# EAGLE schematic ray_pwr (EAGLE 7.7.0)
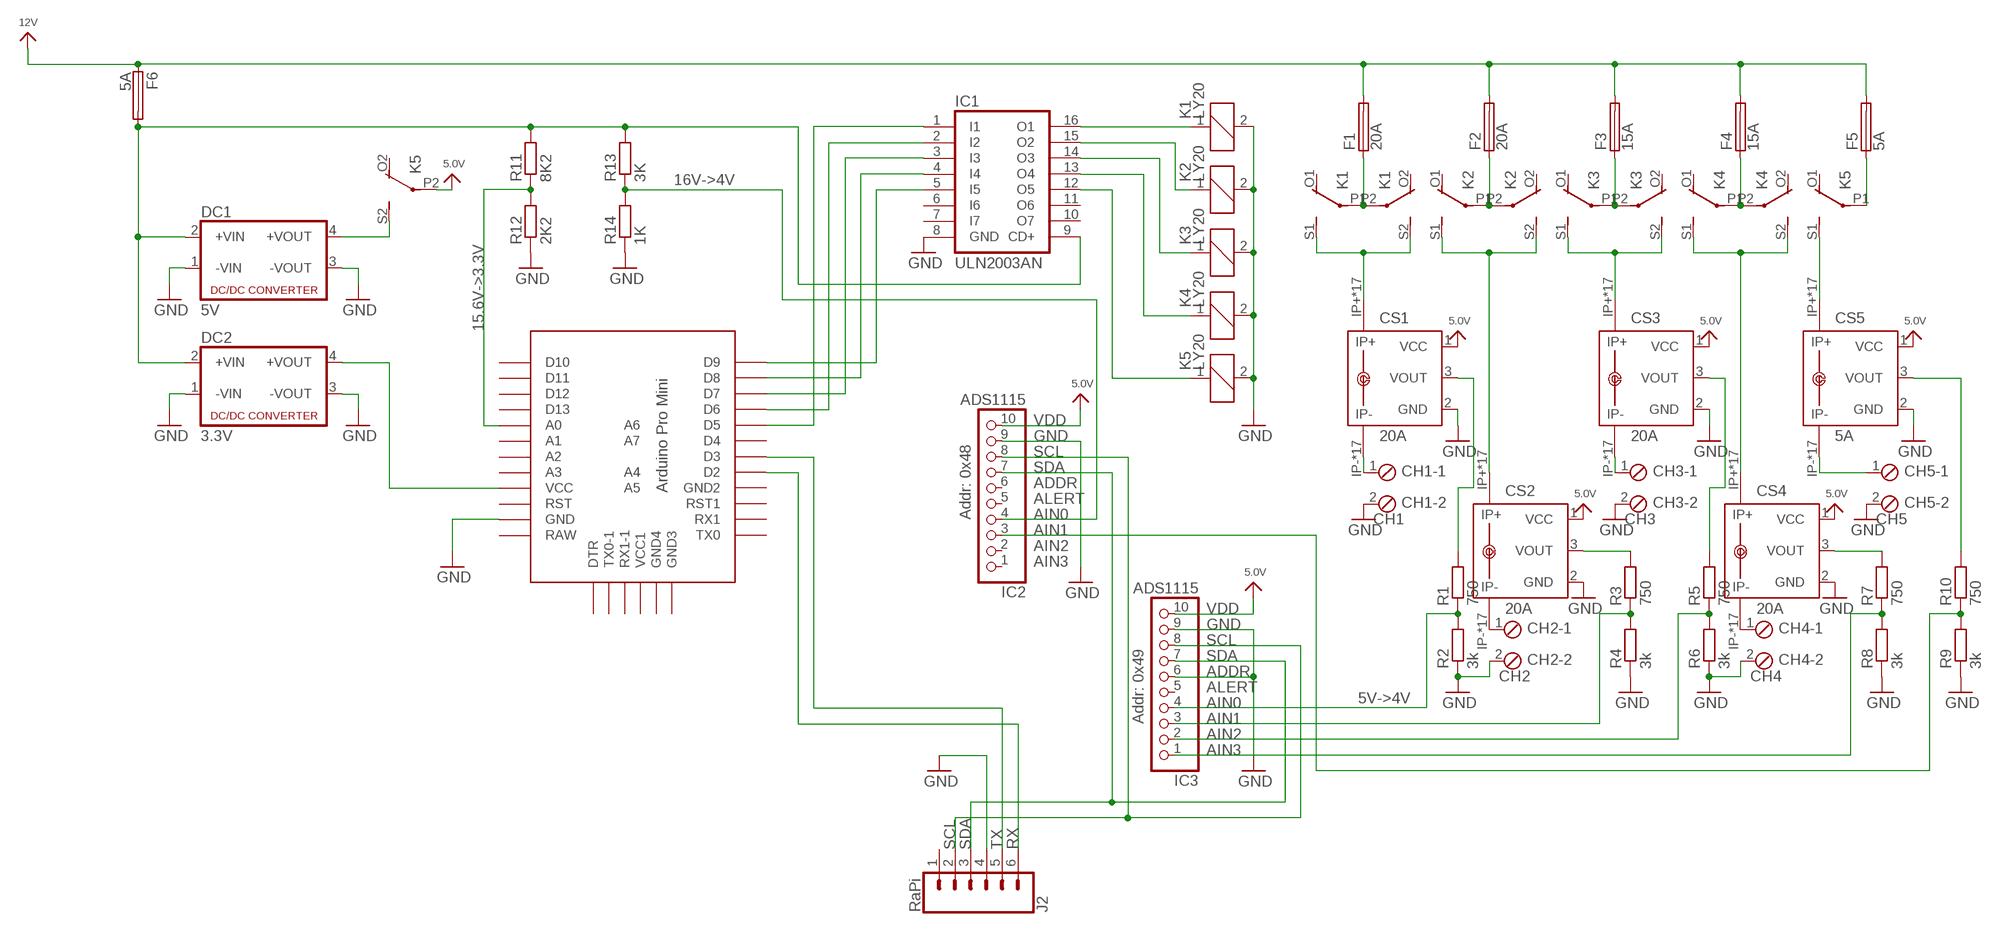
[diagram p0: schematic, sheet 1]

## Parts
CH1  CH1  MPT2  [2POL254]
CH2  CH2  MPT2  [2POL254]
CH3  CH3  MPT2  [2POL254]
CH4  CH4  MPT2  [2POL254]
CH5  CH5  MPT2  [2POL254]
CS1  20A  ACS750LCA-050  [ACS75050]
CS2  20A  ACS750LCA-050  [ACS75050]
CS3  20A  ACS750LCA-050  [ACS75050]
CS4  20A  ACS750LCA-050  [ACS75050]
CS5  5A  ACS750LCA-050  [ACS75050]
DC1  5V  VA-0505S  [4SIL]
DC2  3.3V  VA-0505S  [4SIL]
F1  20A  FUSEBLANK_5X20MM  [FUSE_HOLDER_5X20MM]
F2  20A  FUSEBLANK_5X20MM  [FUSE_HOLDER_5X20MM]
F3  15A  FUSEBLANK_5X20MM  [FUSE_HOLDER_5X20MM]
F4  15A  FUSEBLANK_5X20MM  [FUSE_HOLDER_5X20MM]
F5  5A  FUSEBLANK_5X20MM  [FUSE_HOLDER_5X20MM]
F6  5A  FUSEBLANK_5X20MM  [FUSE_HOLDER_5X20MM]
IC1  ULN2003AN  [DIL16]
IC2  ADS1115  HEADER-1X1070MIL  [1X10_ROUND70]
IC3  ADS1115  HEADER-1X1070MIL  [1X10_ROUND70]
J2  RaPi  CONN_06POLAR  [MOLEX-1X6]
K1  LY20  [LY20]
K2  LY20  [LY20]
K3  LY20  [LY20]
K4  LY20  [LY20]
K5  LY20  [LY20]
R1  750  R-EU_0207/10  [0207/10]
R2  3k  R-EU_0207/10  [0207/10]
R3  750  R-EU_0207/10  [0207/10]
R4  3k  R-EU_0207/10  [0207/10]
R5  750  R-EU_0207/10  [0207/10]
R6  3k  R-EU_0207/10  [0207/10]
R7  750  R-EU_0207/10  [0207/10]
R8  3k  R-EU_0207/10  [0207/10]
R9  3k  R-EU_0207/10  [0207/10]
R10  750  R-EU_0207/10  [0207/10]
R11  8K2  R-EU_0207/10  [0207/10]
R12  2K2  R-EU_0207/10  [0207/10]
R13  3K  R-EU_0207/10  [0207/10]
R14  1K  R-EU_0207/10  [0207/10]
U$1  PRO-MINI-2  [PRO-MINI-2]

## Nets
5.0V: CS1.1(VCC) CS2.1(VCC) CS3.1(VCC) CS4.1(VCC) CS5.1(VCC) IC2.10 IC3.10 K5.P2(3:P)
12V: F1.2 F2.2 F3.2 F4.2 F5.2 F6.1
GND: CH1.2 CH2.2 CH3.2 CH4.2 CS1.2(GND) CS2.2(GND) CS3.2(GND) CS4.2(GND) CS5.2(GND) DC1.1(-VIN) DC1.3(-VOUT) DC2.1(-VIN) DC2.3(-VOUT) IC1.8(GND) IC2.9 IC3.6 IC3.9 K1.2 K2.2 K3.2 K4.2 K5.2 R2.1 R4.1 R6.1 R8.1 R9.1 R12.1 R14.1 U$1.GND
N$1: DC1.2(+VIN) DC2.2(+VIN) F6.2 IC1.9(CD+) R11.2 R13.2
N$2: DC1.4(+VOUT) K5.S2(3:S)
N$3: DC2.4(+VOUT) U$1.VCC
N$4: IC1.1(I1) U$1.D5
N$5: IC1.2(I2) U$1.D6
N$6: IC1.3(I3) U$1.D7
N$7: IC1.4(I4) U$1.D8
N$8: IC1.5(I5) U$1.D9
N$9: R11.1 R12.2 U$1.A0
N$10: IC2.4 R13.1 R14.2
N$11: IC1.16(O1) K1.1
N$12: IC2.7 IC3.7
N$13: IC2.8 IC3.8
N$14: IC1.14(O3) K3.1
N$15: IC1.15(O2) K2.1
N$16: IC1.13(O4) K4.1
N$17: IC1.12(O5) K5.1
N$18: F1.1 K1.P1(2:P) K1.P2(3:P)
N$19: CS1.IP+ CS1.IP+@2(IP+) CS1.IP+@3(IP+) CS1.IP+@4(IP+) CS1.IP+@5(IP+) CS1.IP+@6(IP+) CS1.IP+@7(IP+) CS1.IP+@8(IP+) CS1.IP+@9(IP+) CS1.IP+@10(IP+) CS1.IP+@11(IP+) CS1.IP+@12(IP+) CS1.IP+@13(IP+) CS1.IP+@14(IP+) CS1.IP+@15(IP+) CS1.IP+@16(IP+) CS1.IP+@17(IP+) K1.S1(2:S) K1.S2(3:S)
N$20: F2.1 K2.P1(2:P) K2.P2(3:P)
N$21: F3.1 K3.P1(2:P) K3.P2(3:P)
N$22: F4.1 K4.P1(2:P) K4.P2(3:P)
N$23: F5.1 K5.P1(2:P)
N$24: CS2.IP+ CS2.IP+@2(IP+) CS2.IP+@3(IP+) CS2.IP+@4(IP+) CS2.IP+@5(IP+) CS2.IP+@6(IP+) CS2.IP+@7(IP+) CS2.IP+@8(IP+) CS2.IP+@9(IP+) CS2.IP+@10(IP+) CS2.IP+@11(IP+) CS2.IP+@12(IP+) CS2.IP+@13(IP+) CS2.IP+@14(IP+) CS2.IP+@15(IP+) CS2.IP+@16(IP+) CS2.IP+@17(IP+) K2.S1(2:S) K2.S2(3:S)
N$25: CS3.IP+ CS3.IP+@2(IP+) CS3.IP+@3(IP+) CS3.IP+@4(IP+) CS3.IP+@5(IP+) CS3.IP+@6(IP+) CS3.IP+@7(IP+) CS3.IP+@8(IP+) CS3.IP+@9(IP+) CS3.IP+@10(IP+) CS3.IP+@11(IP+) CS3.IP+@12(IP+) CS3.IP+@13(IP+) CS3.IP+@14(IP+) CS3.IP+@15(IP+) CS3.IP+@16(IP+) CS3.IP+@17(IP+) K3.S1(2:S) K3.S2(3:S)
N$26: CS4.IP+ CS4.IP+@2(IP+) CS4.IP+@3(IP+) CS4.IP+@4(IP+) CS4.IP+@5(IP+) CS4.IP+@6(IP+) CS4.IP+@7(IP+) CS4.IP+@8(IP+) CS4.IP+@9(IP+) CS4.IP+@10(IP+) CS4.IP+@11(IP+) CS4.IP+@12(IP+) CS4.IP+@13(IP+) CS4.IP+@14(IP+) CS4.IP+@15(IP+) CS4.IP+@16(IP+) CS4.IP+@17(IP+) K4.S1(2:S) K4.S2(3:S)
N$27: CS5.IP+ CS5.IP+@2(IP+) CS5.IP+@3(IP+) CS5.IP+@4(IP+) CS5.IP+@5(IP+) CS5.IP+@6(IP+) CS5.IP+@7(IP+) CS5.IP+@8(IP+) CS5.IP+@9(IP+) CS5.IP+@10(IP+) CS5.IP+@11(IP+) CS5.IP+@12(IP+) CS5.IP+@13(IP+) CS5.IP+@14(IP+) CS5.IP+@15(IP+) CS5.IP+@16(IP+) CS5.IP+@17(IP+) K5.S1(2:S)
N$28: CS1.3(VOUT) R1.2
N$29: CS2.3(VOUT)
N$30: U$1.D3
N$31: U$1.D2
N$32: CS3.3(VOUT) R5.2
N$33: CS4.3(VOUT)
N$34: IC3.4 R1.1 R2.2
N$35: IC3.3 R3.1 R4.2
N$36: IC3.2 R5.1 R6.2
N$37: IC3.1 R7.1 R8.2
N$38: IC2.3 R9.2 R10.1
N$39: CS5.3(VOUT) R10.2
N$40: CH2.1 CS2.IP- CS2.IP-@2(IP-) CS2.IP-@3(IP-) CS2.IP-@4(IP-) CS2.IP-@5(IP-) CS2.IP-@6(IP-) CS2.IP-@7(IP-) CS2.IP-@8(IP-) CS2.IP-@9(IP-) CS2.IP-@10(IP-) CS2.IP-@11(IP-) CS2.IP-@12(IP-) CS2.IP-@13(IP-) CS2.IP-@14(IP-) CS2.IP-@15(IP-) CS2.IP-@16(IP-) CS2.IP-@17(IP-)
N$41: CH4.1 CS4.IP- CS4.IP-@2(IP-) CS4.IP-@3(IP-) CS4.IP-@4(IP-) CS4.IP-@5(IP-) CS4.IP-@6(IP-) CS4.IP-@7(IP-) CS4.IP-@8(IP-) CS4.IP-@9(IP-) CS4.IP-@10(IP-) CS4.IP-@11(IP-) CS4.IP-@12(IP-) CS4.IP-@13(IP-) CS4.IP-@14(IP-) CS4.IP-@15(IP-) CS4.IP-@16(IP-) CS4.IP-@17(IP-)
N$42: CH1.1 CS1.IP- CS1.IP-@2(IP-) CS1.IP-@3(IP-) CS1.IP-@4(IP-) CS1.IP-@5(IP-) CS1.IP-@6(IP-) CS1.IP-@7(IP-) CS1.IP-@8(IP-) CS1.IP-@9(IP-) CS1.IP-@10(IP-) CS1.IP-@11(IP-) CS1.IP-@12(IP-) CS1.IP-@13(IP-) CS1.IP-@14(IP-) CS1.IP-@15(IP-) CS1.IP-@16(IP-) CS1.IP-@17(IP-)
N$43: CH3.1 CS3.IP- CS3.IP-@2(IP-) CS3.IP-@3(IP-) CS3.IP-@4(IP-) CS3.IP-@5(IP-) CS3.IP-@6(IP-) CS3.IP-@7(IP-) CS3.IP-@8(IP-) CS3.IP-@9(IP-) CS3.IP-@10(IP-) CS3.IP-@11(IP-) CS3.IP-@12(IP-) CS3.IP-@13(IP-) CS3.IP-@14(IP-) CS3.IP-@15(IP-) CS3.IP-@16(IP-) CS3.IP-@17(IP-)
N$44: CH5.1 CS5.IP- CS5.IP-@2(IP-) CS5.IP-@3(IP-) CS5.IP-@4(IP-) CS5.IP-@5(IP-) CS5.IP-@6(IP-) CS5.IP-@7(IP-) CS5.IP-@8(IP-) CS5.IP-@9(IP-) CS5.IP-@10(IP-) CS5.IP-@11(IP-) CS5.IP-@12(IP-) CS5.IP-@13(IP-) CS5.IP-@14(IP-) CS5.IP-@15(IP-) CS5.IP-@16(IP-) CS5.IP-@17(IP-)
Unconnected: CH5.2 IC1.6(I6) IC1.7(I7) IC1.10(O7) IC1.11(O6) IC2.1 IC2.2 IC2.5 IC2.6 IC3.5 J2.1 J2.2 J2.3 J2.4 J2.5 J2.6 K1.O1(2:O) K1.O2(3:O) K2.O1(2:O) K2.O2(3:O) K3.O1(2:O) K3.O2(3:O) K4.O1(2:O) K4.O2(3:O) K5.O1(2:O) K5.O2(3:O) R3.2 R7.2 U$1.A1 U$1.A2 U$1.A3 U$1.A4 U$1.A5 U$1.A6 U$1.A7 U$1.D4 U$1.D10 U$1.D11 U$1.D12 U$1.D13 U$1.DTR U$1.GND1(GND2) U$1.GND2(GND3) U$1.GND3(GND4) U$1.RAW U$1.RST U$1.RST1 U$1.RX1 U$1.RX1-1 U$1.TX0 U$1.TX0-1 U$1.VCC1

## Notes on the sheet
- 16V->4V
- 15.6V->3.3V
- VDD
- GND
- SCL
- SDA
- ADDR
- ALERT
- Addr: 0x48 | AIN0
- AIN1
- AIN2
- AIN3
- VDD
- GND
- SCL
- SDA
- ADDR
- ALERT | 5V->4V
- AIN0
- Addr: 0x49 | AIN1
- AIN2
- AIN3
- SCL | SDA | TX | RX

## Library data of the parts
CH1-CH5 = con-phoenix-254:MPT2: PHOENIX CONNECTOR; OC_FARNELL: unknown; OC_NEWARK: unknown
CS1-CS5 = allegro:ACS750*CA-050: Current Sensor display layer 49 Reference in BRD and place VIAs on circles Source: www.allegromicro.com/datafile/0750-050.pdf; MF: ALLEGRO MICROSYSTEMS, INC.; MPN: ACS750LCA-050; OC_FARNELL: 1457176; OC_NEWARK: 61H4464
DC1 DC2 = dc-dc-converter:VA-*?: DC DC Converter Single Output, 1 Watt Motien Technology Co.,Ltd. Source: Data sheet <http://www.motien.com.tw/data_sheet/VA-1%28H%29.pdf>; OC_FARNELL: unknown; OC_NEWARK: unknown
F1-F6 = fuse:FUSE: Fuse; OC_FARNELL: unknown; OC_NEWARK: unknown
IC1 = uln-udn:ULN2003A: DRIVER ARRAY
IC2 IC3 = microbuilder:HEADER-1X10: PIN HEADER
J2 = SparkFun-Connectors:CONN_06: Multi connection point. Often used as Generic Header-pin footprint for 0.1 inch spaced/style header connections On any of the 0.1 inch spaced packages, you can populate with these: Break Away Headers - Straight <https://www.sparkfun.com/products/116> (PRT-00116) Break Away Male Headers - Right Angle <https://www.sparkfun.com/products/553> (PRT-00553) Female Headers <https://www.sparkfun.com/products/115> (PRT-00115) Break Away Headers - Machine Pin <https://www.sparkfun.com/products/117> (PRT-00117) Break Away Female Headers - Swiss Machine Pin <https://www.sparkfun.com/products/743> (PRT-00743) Arduino Stackable Header - 6 Pin <https://www.sparkfun.com/products/9280> (PRT-09280) For SCREWTERMINALS and SPRING TERMINALS visit here: Screw Terimnals on SparkFun.com <https://www.sparkfun.com/search/results?term=Screw+Terminals> (5mm/3.5mm/2.54mm spacing) This device is also useful as a general connection point to wire up your design to another part of your project. Our various solder wires solder well into these plated through hole pads. Hook-Up Wire - Assortment (Stranded, 22 AWG) <https://www.sparkfun.com/products/11375> (PRT-11375) Hook-Up Wire - Assortment (Solid Core, 22 AWG) <https://www.sparkfun.com/products/11367> (PRT-11367) View the entire wire category on our website here <https://www.sparkfun.com/categories/141>
K1-K5 = relay:LY20: RELAY 2 x switch, Omron; OC_FARNELL: unknown; OC_NEWARK: unknown
R1-R14 = resistor:R-EU_: RESISTOR, European symbol
U$1 = Arduino-clone:PRO-MINI-2: Arduino Pro Mini Layout 2 Sparkfun.com